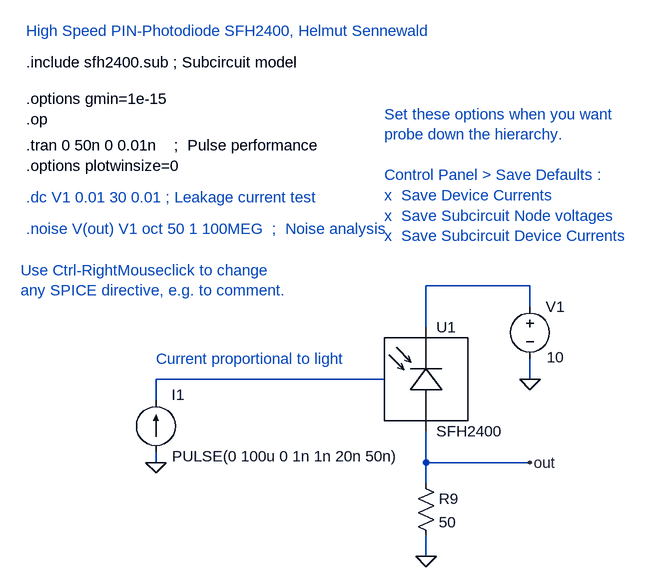
[diagram p0: schematic sfh2400_test.asc]
sfh2400_test.asc, the LTspice schematic file:
Version 4
SHEET 1 1668 1860
WIRE -656 560 -656 528
WIRE -656 656 -656 640
WIRE -304 528 -656 528
WIRE -240 448 -240 384
WIRE -240 656 -240 608
WIRE -240 688 -240 656
WIRE -240 800 -240 768
WIRE -80 384 -240 384
WIRE -80 416 -80 384
WIRE -80 528 -80 496
WIRE -80 656 -240 656
FLAG -80 528 0
FLAG -240 800 0
FLAG -80 656 out
FLAG -656 656 0
SYMBOL voltage -80 400 R0
WINDOW 123 24 44 Left 0
WINDOW 39 0 0 Left 0
WINDOW 3 26 94 Left 0
SYMATTR Value 10
SYMATTR InstName V1
SYMBOL res -256 672 R0
SYMATTR InstName R9
SYMATTR Value 50
SYMBOL current -656 640 M180
WINDOW 0 24 88 Left 0
WINDOW 3 25 -6 Left 0
WINDOW 123 0 0 Left 0
WINDOW 39 0 0 Left 0
SYMATTR InstName I1
SYMATTR Value PULSE(0 100u 0 1n 1n 20n 50n)
SYMBOL sfh2400 -240 528 R0
SYMATTR InstName U1
TEXT -856 128 Left 0 !.op
TEXT -856 96 Left 0 !.options gmin=1e-15
TEXT -856 296 Left 0 ;.noise V(out) V1 oct 50 1 100MEG  ;  Noise analysis
TEXT -856 168 Left 0 !.tran 0 50n 0 0.01n    ;  Pulse performance\n.options plotwinsize=0
TEXT -856 248 Left 0 ;.dc V1 0.01 30 0.01 ; Leakage current test
TEXT -856 40 Left 0 !.include sfh2400.sub ; Subcircuit model
TEXT -864 360 Left 0 ;Use Ctrl-RightMouseclick to change \nany SPICE directive, e.g. to comment.
TEXT -304 120 Left 0 ;Set these options when you want \nprobe down the hierarchy.\n \nControl Panel > Save Defaults : \nx  Save Device Currents\nx  Save Subcircuit Node voltages\nx  Save Subcircuit Device Currents
TEXT -856 -8 Left 0 ;High Speed PIN-Photodiode SFH2400, Helmut Sennewald
TEXT -656 496 Left 0 ;Current proportional to light

The netlist it stands for:
* sfh2400_test.asc
V1 N002 0 10
R9 out 0 50
I1 0 N001 PULSE(0 100u 0 1n 1n 20n 50n)
XU1 out N002 N001 SFH2400  ; pins A K L
.op
.options gmin=1e-15
* .noise V(out) V1 oct 50 1 100MEG  ;  Noise analysis
.tran 0 50n 0 0.01n    ;  Pulse performance
.options plotwinsize=0
* .dc V1 0.01 30 0.01 ; Leakage current test
.include sfh2400.sub ; Subcircuit model
* Use Ctrl-RightMouseclick to change
* any SPICE directive, e.g. to comment.
* Set these options when you want
* probe down the hierarchy.
* Control Panel > Save Defaults :
* x  Save Device Currents
* x  Save Subcircuit Node voltages
* x  Save Subcircuit Device Currents
* High Speed PIN-Photodiode SFH2400, Helmut Sennewald
* Current proportional to light
.backanno
.end